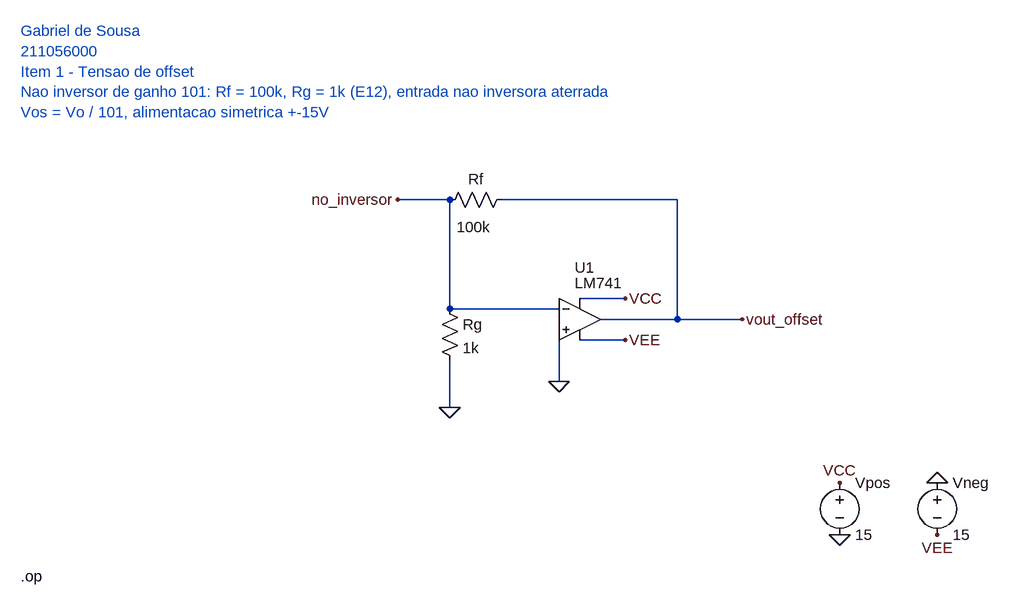
[diagram p0: schematic item_1.asc]
item_1.asc, the LTspice schematic file:
Version 4.1
SHEET 1 1600 850
WIRE 868 348 700 348
WIRE 700 348 700 180
WIRE 700 428 700 500
WIRE 780 180 1050 180
WIRE 1050 180 1050 364
WIRE 932 364 1150 364
WIRE 868 380 868 460
WIRE 900 332 970 332
WIRE 900 396 970 396
FLAG 700 500 0
FLAG 1150 364 vout_offset
FLAG 868 460 0
FLAG 970 332 VCC
FLAG 970 396 VEE
FLAG 1300 616 VCC
FLAG 1300 696 0
FLAG 1450 616 0
FLAG 1450 696 VEE
SYMBOL LM741 900 300 R0
WINDOW 0 -8 -16 Left 2
WINDOW 3 -8 8 Left 2
SYMATTR InstName U1
SYMBOL res 684 332 R0
SYMATTR InstName Rg
SYMATTR Value 1k
SYMBOL res 796 164 R90
WINDOW 0 0 56 VBottom 2
WINDOW 3 58 59 VCenter 2
SYMATTR InstName Rf
SYMATTR Value 100k
SYMBOL voltage 1300 600 R0
SYMATTR InstName Vpos
SYMATTR Value 15
SYMBOL voltage 1450 600 R0
SYMATTR InstName Vneg
SYMATTR Value 15
TEXT 40 -80 Left 2 ;Gabriel de Sousa\n211056000\nItem 1 - Tensao de offset\nNao inversor de ganho 101: Rf = 100k, Rg = 1k (E12), entrada nao inversora aterrada\nVos = Vo / 101, alimentacao simetrica +-15V
TEXT 40 760 Left 2 !.op
WIRE 620 180 700 180
FLAG 620 180 no_inversor

The netlist it stands for:
* item_1.asc
X§U1 0 no_inversor VCC VEE vout_offset LM741  ; pins In+ In- V+ V- OUT
Rg no_inversor 0 1k
Rf vout_offset no_inversor 100k
Vpos VCC 0 15
Vneg 0 VEE 15
* Gabriel de Sousa
* 211056000
* Item 1 - Tensao de offset
* Nao inversor de ganho 101: Rf = 100k, Rg = 1k (E12), entrada nao inversora aterrada
* Vos = Vo / 101, alimentacao simetrica +-15V
.op
.lib LM741.lib
.backanno
.end